# Altium schematic sheet adc-peripheral.SchDoc
size B
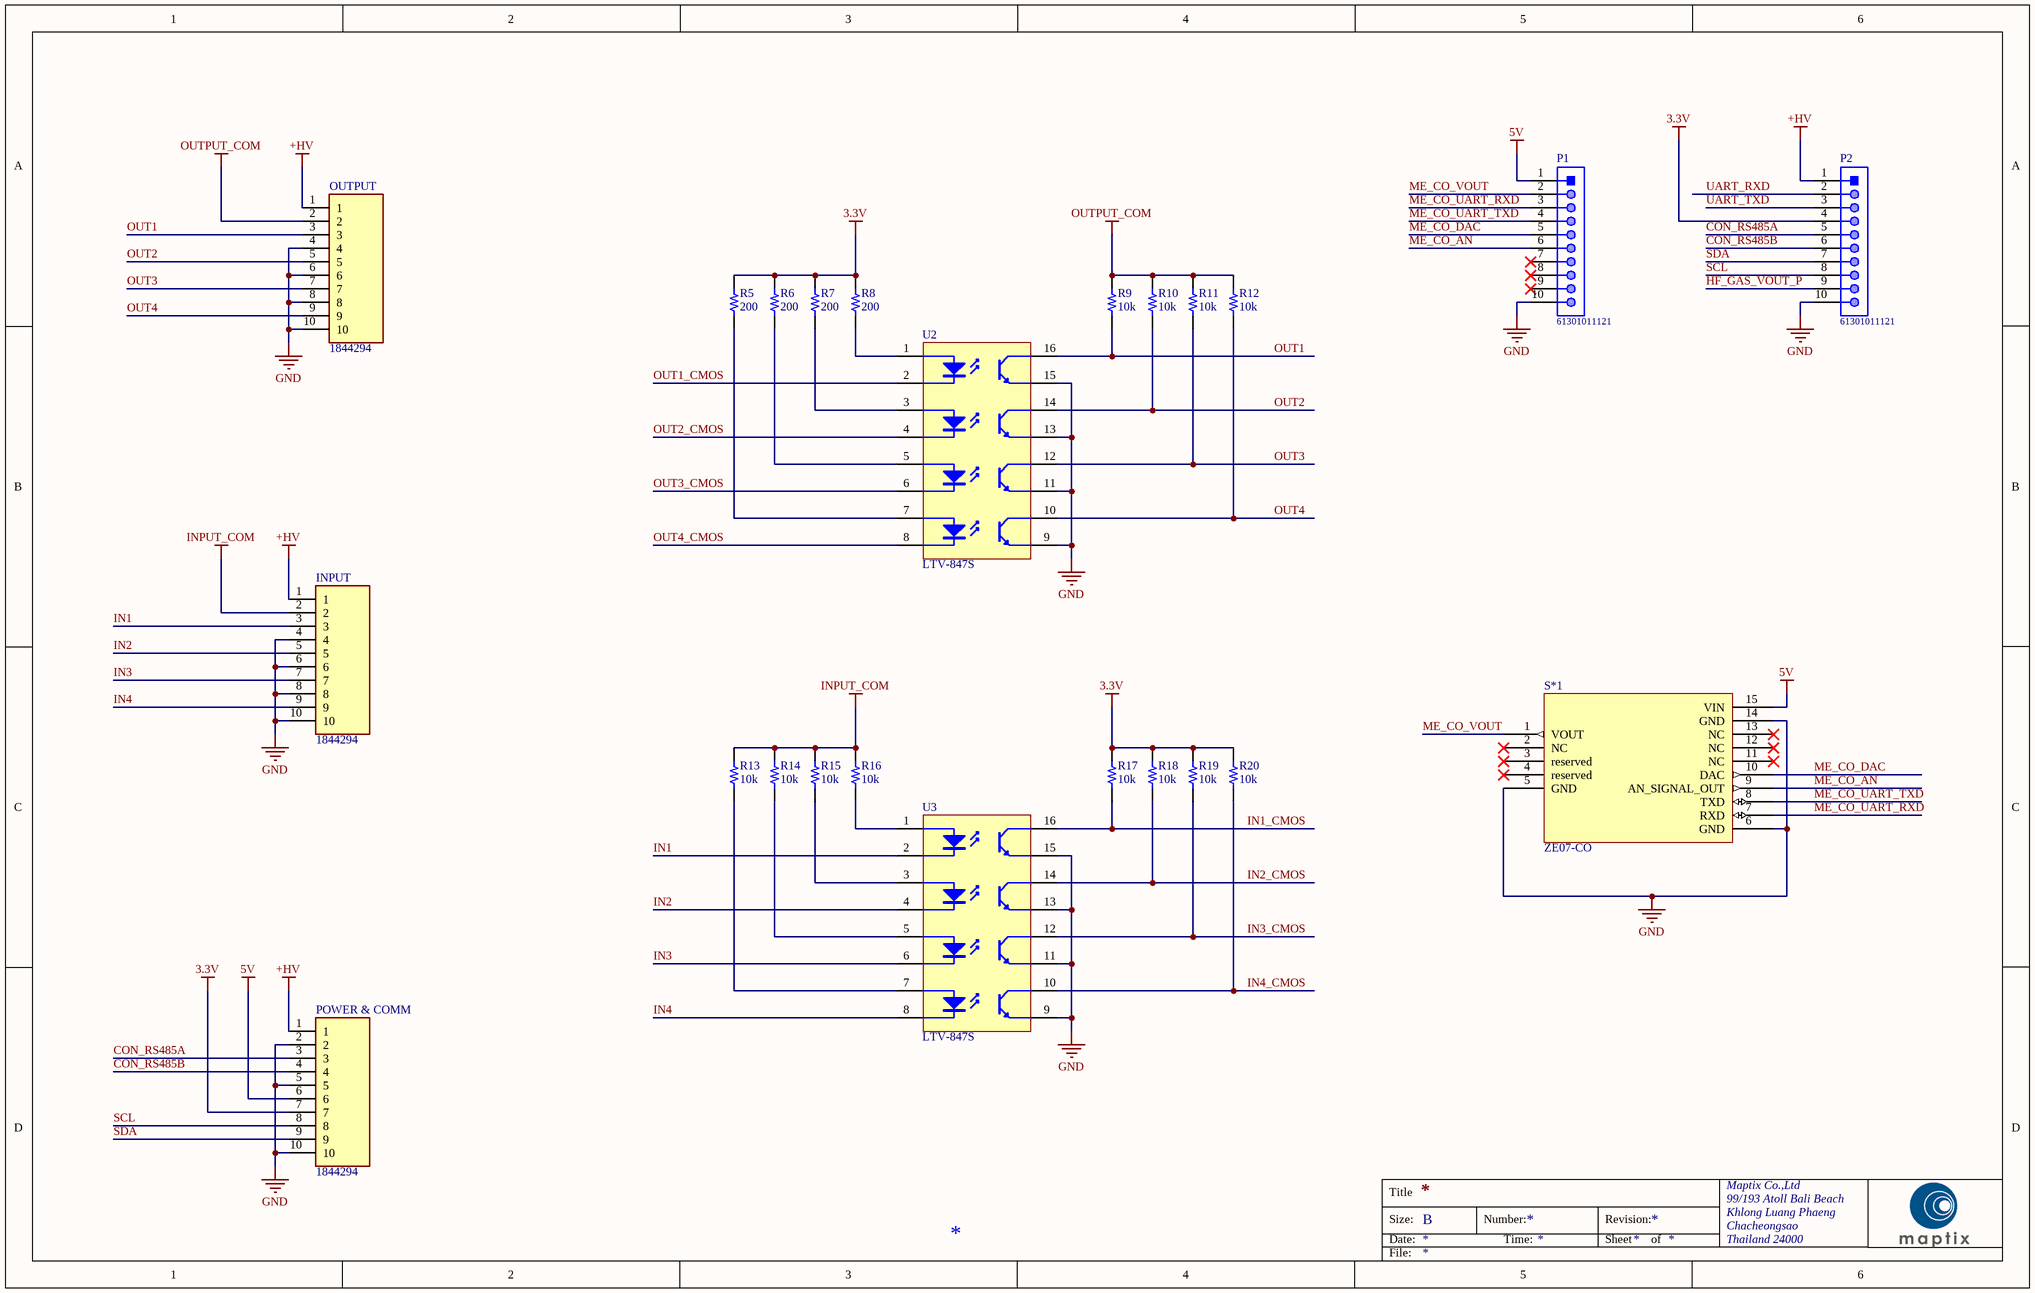
[diagram p0: adc-peripheral.SchDoc]

## Parts
INPUT  1844294  [SHDR10W100P0X350_1X10_3640X920X725P]
OUTPUT  1844294  [SHDR10W100P0X350_1X10_3640X920X725P]
P1  61301011121  [61301011121]
P2  61301011121  [61301011121]
POWER_&_COMM  1844294  [SHDR10W100P0X350_1X10_3640X920X725P]
R5  200  [RES 0603_1608]
R6  200  [RES 0603_1608]
R7  200  [RES 0603_1608]
R8  200  [RES 0603_1608]
R9  10k  [RES 0603_1608]
R10  10k  [RES 0603_1608]
R11  10k  [RES 0603_1608]
R12  10k  [RES 0603_1608]
R13  10k  [RES 0603_1608]
R14  10k  [RES 0603_1608]
R15  10k  [RES 0603_1608]
R16  10k  [RES 0603_1608]
R17  10k  [RES 0603_1608]
R18  10k  [RES 0603_1608]
R19  10k  [RES 0603_1608]
R20  10k  [RES 0603_1608]
S*1  ZE07-CO  [ZE07-CO]
U2  LTV-847S  [LTST-LTV-847S_V]
U3  LTV-847S  [LTST-LTV-847S_V]

## Nets
3.3V: P2.4 POWER_&_COMM.7 R5.2 R6.2 R7.2 R8.2 R17.2 R18.2 R19.2 R20.2
5V: P1.1 POWER_&_COMM.6 S*1.15(VIN)
+HV: INPUT.1 OUTPUT.1 P2.1 POWER_&_COMM.1
GND: INPUT.4 INPUT.6 INPUT.8 INPUT.10 OUTPUT.4 OUTPUT.6 OUTPUT.8 OUTPUT.10 P1.10 P2.10 POWER_&_COMM.2 POWER_&_COMM.5 POWER_&_COMM.10 S*1.5(GND) S*1.6(GND) S*1.14(GND) U2.9(Emitter4) U2.11(Emitter3) U2.13(Emitter2) U2.15(Emitter1) U3.9(Emitter4) U3.11(Emitter3) U3.13(Emitter2) U3.15(Emitter1)
INPUT_COM: INPUT.2 R13.2 R14.2 R15.2 R16.2
OUTPUT_COM: OUTPUT.2 R9.2 R10.2 R11.2 R12.2
CON_RS485A: P2.5 POWER_&_COMM.3
CON_RS485B: P2.6 POWER_&_COMM.4
HF_GAS_VOUT_P: P2.9
IN1: INPUT.3 U3.2(Cathode1)
IN1_CMOS: R17.1 U3.16(Collector1)
IN2: INPUT.5 U3.4(Cathode2)
IN2_CMOS: R18.1 U3.14(Collector2)
IN3: INPUT.7 U3.6(Cathode3)
IN3_CMOS: R19.1 U3.12(Collector3)
IN4: INPUT.9 U3.8(Cathode4)
IN4_CMOS: R20.1 U3.10(Collector4)
ME_CO_AN: P1.6 S*1.9(AN_SIGNAL_OUT)
ME_CO_DAC: P1.5 S*1.10(DAC)
ME_CO_UART_RXD: P1.3 S*1.7(RXD)
ME_CO_UART_TXD: P1.4 S*1.8(TXD)
ME_CO_VOUT: P1.2 S*1.1(VOUT)
OUT1: OUTPUT.3 R9.1 U2.16(Collector1)
OUT1_CMOS: U2.2(Cathode1)
OUT2: OUTPUT.5 R10.1 U2.14(Collector2)
OUT2_CMOS: U2.4(Cathode2)
OUT3: OUTPUT.7 R11.1 U2.12(Collector3)
OUT3_CMOS: U2.6(Cathode3)
OUT4: OUTPUT.9 R12.1 U2.10(Collector4)
OUT4_CMOS: U2.8(Cathode4)
SCL: P2.8 POWER_&_COMM.8
SDA: P2.7 POWER_&_COMM.9
UART_RXD: P2.2
UART_TXD: P2.3
NetR5_1: R5.1 U2.7(Anode4)
NetR6_1: R6.1 U2.5(Anode3)
NetR7_1: R7.1 U2.3(Anode2)
NetR8_1: R8.1 U2.1(Anode1)
NetR13_1: R13.1 U3.7(Anode4)
NetR14_1: R14.1 U3.5(Anode3)
NetR15_1: R15.1 U3.3(Anode2)
NetR16_1: R16.1 U3.1(Anode1)

Not connected (* = marked no-connect by the designer): P1 7* 8* 9*; S*1 2(NC)* 3(reserved)* 4(reserved)* 11(NC)* 12(NC)* 13(NC)*

## Notes on the sheet
- Title
- Size:
- Date:
- B
- Number:
- Time:
- Revision:
- Sheet
- of
- Maptix Co.,Ltd
- 99/193 Atoll Bali Beach
- Khlong Luang Phaeng
- Chacheongsao
- Thailand 24000
- File:

## Library data of the parts
INPUT OUTPUT POWER_&_COMM = 1844294: Connector; Manufacturer_Name: Phoenix Contact; Allied_Number: 70054526; Datasheet Link: http://docs-emea.rs-online.com/webdocs/12bb/0900766b812bb07b.pdf; Height: 7.25mm; Manufacturer_Part_Number: 1844294; Mouser Part Number: 651-1844294; Mouser Price/Stock: https://www.mouser.com/Search/Refine.aspx?Keyword=651-1844294; RS Part Number: 8042267; RS Price/Stock: http://uk.rs-online.com/web/p/products/8042267; Allied Price/Stock: http://www.alliedelec.com/phoenix-contact-1844294/70054526/
P1 P2 = CMP-1502-01082-1: THT Vertical Pin Header WR-PHD, Pitch 2.54 mm, Single Row, 10 pins; Manufacturer: Wurth Elektronik; Contact Resistance: 20mOhm; Rated Current: 3A; Pitch: 2.54mm; Gender: Male; Pin Number: 10; Working Voltage: 250VAC; Withstanding Voltage: 500VAC; Manufacturer URL: http://www.we-online.de; Operating Temperature: -40to105degC; Datasheet URL: https://katalog.we-online.de/em/datasheet/6130xx11121.pdf; Row Number: Single; Orientation: Vertical; Part Number: 61301011121; Packaging: Bag; Package Reference: 61301011121; Mounting Technology: THT; Publisher: WurthElektronik
R5-R20 = CRCW060329K4FKEA: Resistor; Manufacturer: Vishay Dale; Power (Watts): 0.1W, 1/10W; Resistance: 29.4 kOhms; Temperature Coefficient: ±100ppm/°C; Tolerance: ±1%; Part Number: CRCW060329K4FKEA; ComponentLink1Description: Datasheet; ComponentLink1URL: http://www.vishay.com/docs/20035/dcrcwe3.pdf; ComponentLink2Description: DigiKey Link; ComponentLink2URL: http://digikey.com/product-detail/en/vishay-dale/CRCW060329K4FKEA/541-29.4KHCT-ND/1179975; Composition: Thick Film; Device Package: 0603 (1608 Metric); Features: Automotive AEC-Q200; Height - Seated (Max): 0.020" (0.50mm); LastUpdated: 1/2/2020 12:06:58 AM; Lifecycle Status: Active; Minimum Order: 1; Number of Terminations: 2; Operating Temperature: -55°C ~ 155°C; Package / Case: 0603 (1608 Metric); Packaging: TapeAndReel; PartId: 7975; Part Status: Active; Price: 0.00; Ratings: AEC-Q200; Series: CRCW; Size / Dimension: 0.061" L x 0.033" W (1.55mm x 0.85mm); Supplier 1: DigiKey; Supplier Part Number 1: 541-29.4KHCT-ND; Supplier Device Package: 0603
  R5-R8: Value: 200
  R9-R20: Value: 10k
U2 U3 = CMP-2000-06633-1: Photocoupler, 50 mA, -30 to 110 degC, 16-Pin SMD, RoHS, Tube; Manufacturer: Lite-On; Output Voltage-Max: 35V; CTR-Min: 50%; No of Channels: 4; Isolation Voltage-Max: 5000V; Package Reference: LTV-847S; Operating Temp-Max: 100°C; Datasheet Version: Rev. K, 03/2010; Datasheet URL: http://optoelectronics.liteon.com/upload/download/DS-70-96-0016/S_110_LTV-817%20%20827%20%20847%20(%20M,%20S,%20S-TA,%20S-TA1,%20S-TP%20)%20Series.pdf; Manufacturer URL: http://www.us.liteon.com/; Package Description: 16-Pin Surface Mount Device, Body 19.84 x 6.5 mm, Pitch 2.54 mm; Mounting Technology: SurfaceMount